# Altium schematic sheet communication.SchDoc
size A4
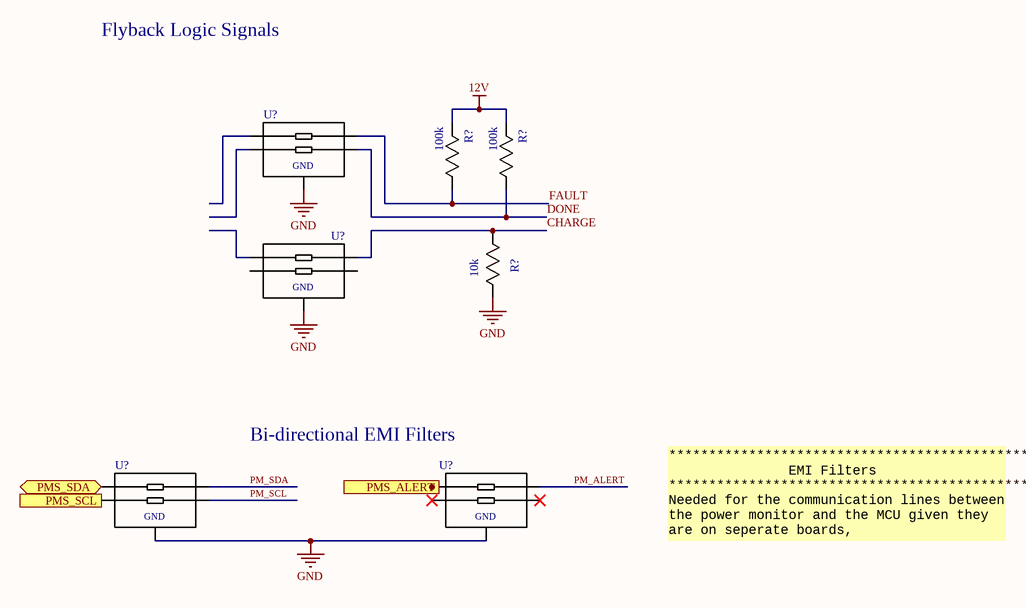
[diagram p0: communication.SchDoc]

## Parts
(Parts that share a designator on the sheet are numbered #1, #2 ... from top to bottom, then left to right.)
R?#1  100k  [0805]
R?#2  100k  [0805]
R?#3  10k  [0805]
U?#1  EMI  [SOT-665]  (value not drawn)
U?#2  EMI  [SOT-665]  (value not drawn)
U?#3  EMI  [SOT-665]  (value not drawn)
U?#4  EMI  [SOT-665]  (value not drawn)

## Ports
PMS_ALERT (in), PMS_SCL (out), PMS_SDA (bidir)

## Nets
12V: R?#1.2(R2) R?#2.2(R2)
GND: R?#3.1(R1) U?#1.2(P$2) U?#2.2(P$2) U?#3.2(P$2) U?#4.2(P$2)
CHARGE: R?#3.2(R2) U?#2.5(P$5)
DONE: R?#2.1(R1) U?#1.4(P$4)
FAULT: R?#1.1(R1) U?#1.5(P$5)
PM_ALERT: U?#4.5(P$5)
PM_SCL: U?#3.4(P$4)
PM_SDA: U?#3.5(P$5)
PMS_SCL: U?#3.3(P$3) ; port PMS_SCL
PMS_SDA: U?#3.1(P$1) ; port PMS_SDA

Not connected (* = marked no-connect by the designer): U?#1 1(P$1) 3(P$3); U?#2 1(P$1) 3(P$3) 4(P$4); U?#4 1(P$1) 3(P$3)* 4(P$4)*

## Notes on the sheet
- Flyback Logic Signals
- (near U?#4) Bi-directional EMI Filters
- *********************************************
  EMI Filters
  *********************************************
  Needed for the communication lines between the power monitor and the MCU given they are on seperate boards,
- (in symbol EMI FILTER IP4256CZ5-W) GND
- (in symbol IP4256CZ5-W) GND

## Library data of the parts
R?#1 R?#2 = RES 100k 0805: RES SMD 100K OHM 1% 1/8W 0805; MP: RC0805FR-07100KL; MF: Yageo; Rating: 0.125W; Digikey: 311-100KCRCT-ND; Price: 0.058 CAD; Package: 0805; Value: 100k; Digikey Link: https://www.digikey.ca/products/en?keywords=311-100KCRCT-ND; Tolerance: 1%
R?#3 = RES 10k 1/8W: RES SMD 10K OHM 1% 1/8W 0805; Power (Watts): 0.125W; Package: 0805; Value: 10k; Tolerance: 1%
U?#1 U?#2 = EMI FILTER IP4256CZ5-W: FILTER RC(PI) 100 OHM/19PF SMD; MF: Nexperia USA Inc.; MP: IP4256CZ5-W,115; SnapEDA_Link: https://www.snapeda.com/parts/IP4256CZ5-W/Nexperia%20USA%20Inc./view-part/3605439/?ref=snap; Price: 0.17 CAD; Package: SOT-665; Digikey: 1727-4718-1-ND; Digikey Link: https://www.digikey.ca/product-detail/en/nexperia-usa-inc/IP4256CZ5-W115/1727-4718-1-ND/2531158
U?#3 U?#4 = IP4256CZ5-W: RC (Pi) EMI Filter 2nd Order Low Pass 2 Channel R = 100Ohms, C = 19pF (Total)  SOT-665; MF: Nexperia USA Inc.; MP: IP4256CZ5-W,115; SnapEDA_Link: https://www.snapeda.com/parts/IP4256CZ5-W/Nexperia%20USA%20Inc./view-part/3605439/?ref=snap; Price: 0.17 CAD; Package: SOT-665; Digikey: 1727-4718-1-ND; Digikey Link: https://www.digikey.ca/product-detail/en/nexperia-usa-inc/IP4256CZ5-W115/1727-4718-1-ND/2531158